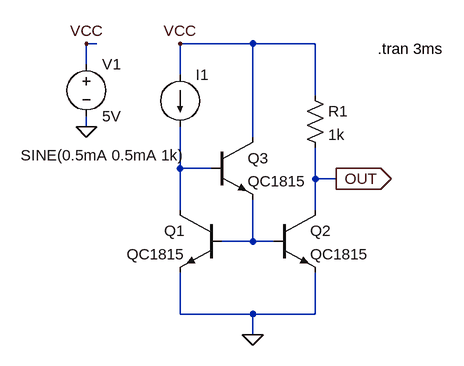
[diagram p0: schematic CurrentMirror2_sine.asc]
CurrentMirror2_sine.asc, the LTspice schematic file:
Version 4
SHEET 1 880 680
WIRE -400 -208 -416 -208
WIRE -160 -208 -272 -208
WIRE -64 -208 -160 -208
WIRE -416 -176 -416 -208
WIRE -272 -160 -272 -208
WIRE -64 -128 -64 -208
WIRE -416 -80 -416 -96
WIRE -160 -64 -160 -208
WIRE -272 -16 -272 -80
WIRE -224 -16 -272 -16
WIRE -64 0 -64 -48
WIRE -32 0 -64 0
WIRE -272 48 -272 -16
WIRE -64 48 -64 0
WIRE -160 96 -160 32
WIRE -160 96 -208 96
WIRE -128 96 -160 96
WIRE -272 208 -272 144
WIRE -160 208 -272 208
WIRE -64 208 -64 144
WIRE -64 208 -160 208
WIRE -160 240 -160 208
FLAG -160 240 0
FLAG -272 -208 VCC
FLAG -416 -80 0
FLAG -416 -208 VCC
FLAG -32 0 OUT
IOPIN -32 0 Out
SYMBOL npn -208 48 M0
SYMATTR InstName Q1
SYMATTR Value QC1815
SYMBOL npn -128 48 R0
SYMATTR InstName Q2
SYMATTR Value QC1815
SYMBOL current -272 -160 R0
WINDOW 123 0 0 Left 2
WINDOW 39 0 0 Left 2
WINDOW 3 -245 124 Left 2
SYMATTR InstName I1
SYMATTR Value SINE(0.5mA 0.5mA 1k)
SYMBOL res -80 -144 R0
SYMATTR InstName R1
SYMATTR Value 1k
SYMBOL voltage -416 -192 R0
WINDOW 123 0 0 Left 2
WINDOW 39 0 0 Left 2
SYMATTR InstName V1
SYMATTR Value 5V
SYMBOL npn -224 -64 R0
SYMATTR InstName Q3
SYMATTR Value QC1815
TEXT 32 -200 Left 2 !.tran 3ms

The netlist it stands for:
* CurrentMirror2_sine.asc
Q1 N001 N002 0 0 QC1815
Q2 OUT N002 0 0 QC1815
I1 VCC N001 SINE(0.5mA 0.5mA 1k)
R1 VCC OUT 1k
V1 VCC 0 5V
Q3 VCC N001 N002 0 QC1815
.model NPN NPN
.model PNP PNP
.lib standard.bjt
.tran 3ms
.backanno
.end